# Altium project bldc_driver.PrjPCB
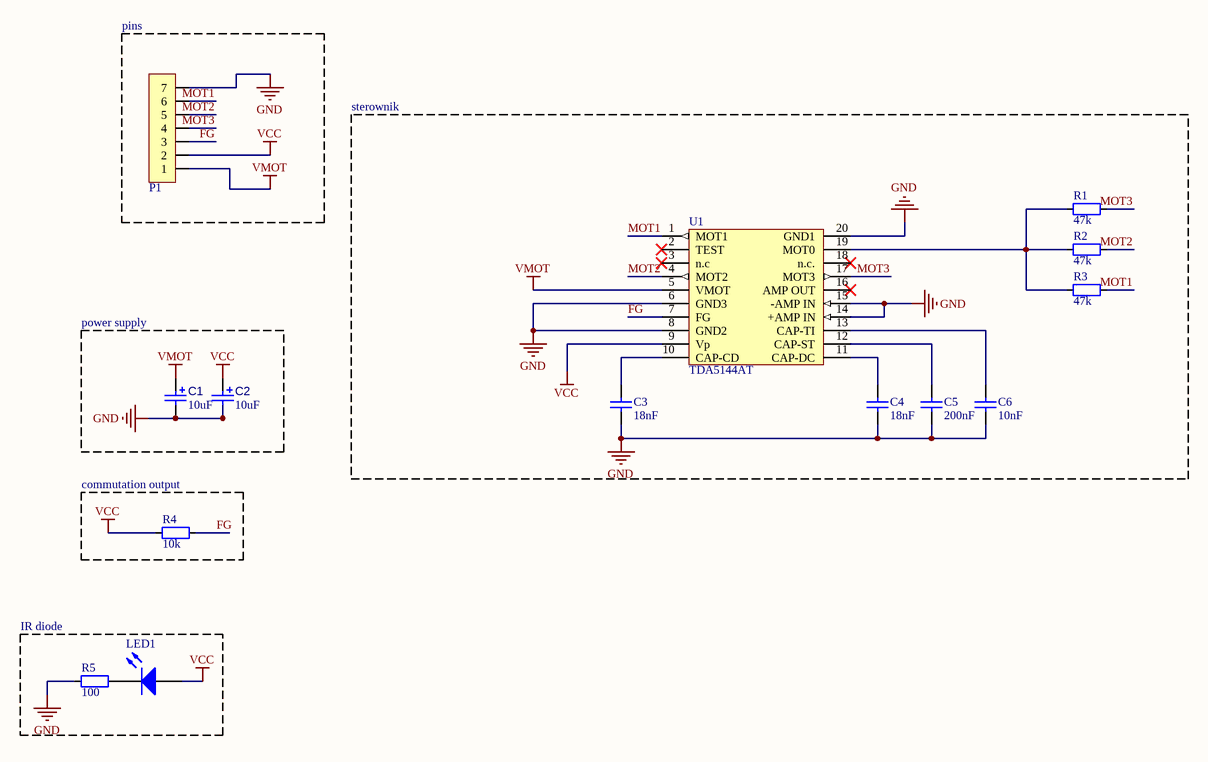
[diagram p0: bldc_driver.SchDoc]
1 sheet, 14 parts. Net scope: global (net labels, ports and power ports of the same name join across sheets).
Board file: bldc_driver.PcbDoc

## Sheet bldc_driver.SchDoc: bldc driver
size A4; DrawnBy: Jakub Wieczorek; Engineer: Jakub Wieczorek; SheetNumber: 1

### Parts
C1  10uF  [Con_SMD_5x5.5]
C2  10uF  [Con_SMD_5x5.5]
C3  value 18nF  [0603_CAP]  (hidden comment: Cap)
C4  value 18nF  [0603_CAP]  (hidden comment: Cap)
C5  value 200nF  [0603_CAP]  (hidden comment: Cap)
C6  value 10nF  [0603_CAP]  (hidden comment: Cap)
LED1  RED  [VSMB2020X01]  (value not drawn)
P1  HDR1X7  [HDR1X7]  (value not drawn)
R1  47k  [0603_RES]
R2  47k  [0603_RES]
R3  47k  [0603_RES]
R4  10k  [0603_RES]
R5  100  [0603_RES]
U1  TDA5144AT  [SO20]

### Blocks framed on the sheet
pins: P1
sterownik: C3-C6 R1-R3 U1
power supply: C1 C2
commutation output: R4
IR diode: LED1 R5

### Nets
GND: C1.2 C2.2 C3.1 C4.1 C5.1 C6.1 P1.7 R5.1 U1.6(GND3) U1.8(GND2) U1.14(+AMP_IN) U1.15(-AMP_IN) U1.20(GND1)
VCC: C2.1 LED1.1(A) P1.2 R4.1 U1.9(Vp)
VMOT: C1.1 P1.1 U1.5(VMOT)
FG: P1.3 R4.2 U1.7(FG)
MOT1: P1.6 R3.2 U1.1(MOT1)
MOT2: P1.5 R2.2 U1.4(MOT2)
MOT3: P1.4 R1.2 U1.17(MOT3)
NetC3_2: C3.2 U1.10(CAP-CD)
NetC4_2: C4.2 U1.11(CAP-DC)
NetC5_2: C5.2 U1.12(CAP-ST)
NetC6_2: C6.2 U1.13(CAP-TI)
NetLED1_2: LED1.2(K) R5.2
NetR1_1: R1.1 R2.1 R3.1 U1.19(MOT0)

Not connected (* = marked no-connect by the designer): U1 2(TEST)* 3(n.c)* 16(AMP_OUT)* 18(n.c.)*

### Library data of the parts
C1 C2 = Cap_Pol: Polar capacitor; Value: 10uF
C3-C6 = Cap: Ceramic capacitor; Unit Price1: *; Unit Price2: *
LED1 = LED: Light-emitting diode; COLOR: RED
P1 = HDR1X7: Header, 7-Pin; LatestRevisionDate: 17-Jul-2002; LatestRevisionNote: Re-released for DXP Platform.; Publisher: Altium Limited
R1-R5 = RES: Resistior
  R1-R3: Value: 47k
  R4: Value: 10k
  R5: Value: 100
U1 = driver_TDA5144AT: driver TDA5144AT; ComponentLink1Description: TDA5144_data_scheet; ComponentLink1URL: .\data_sheets\TDA5144_data_sheet.pdf; ComponentLink2Description: SO-20; ComponentLink2URL: .\data_sheets\SOT163-1_data_sheet.pdf